# EAGLE schematic Haptic Sleeve Schematic (EAGLE 9.6.2)
DESIGNER: Grant Stankaitis
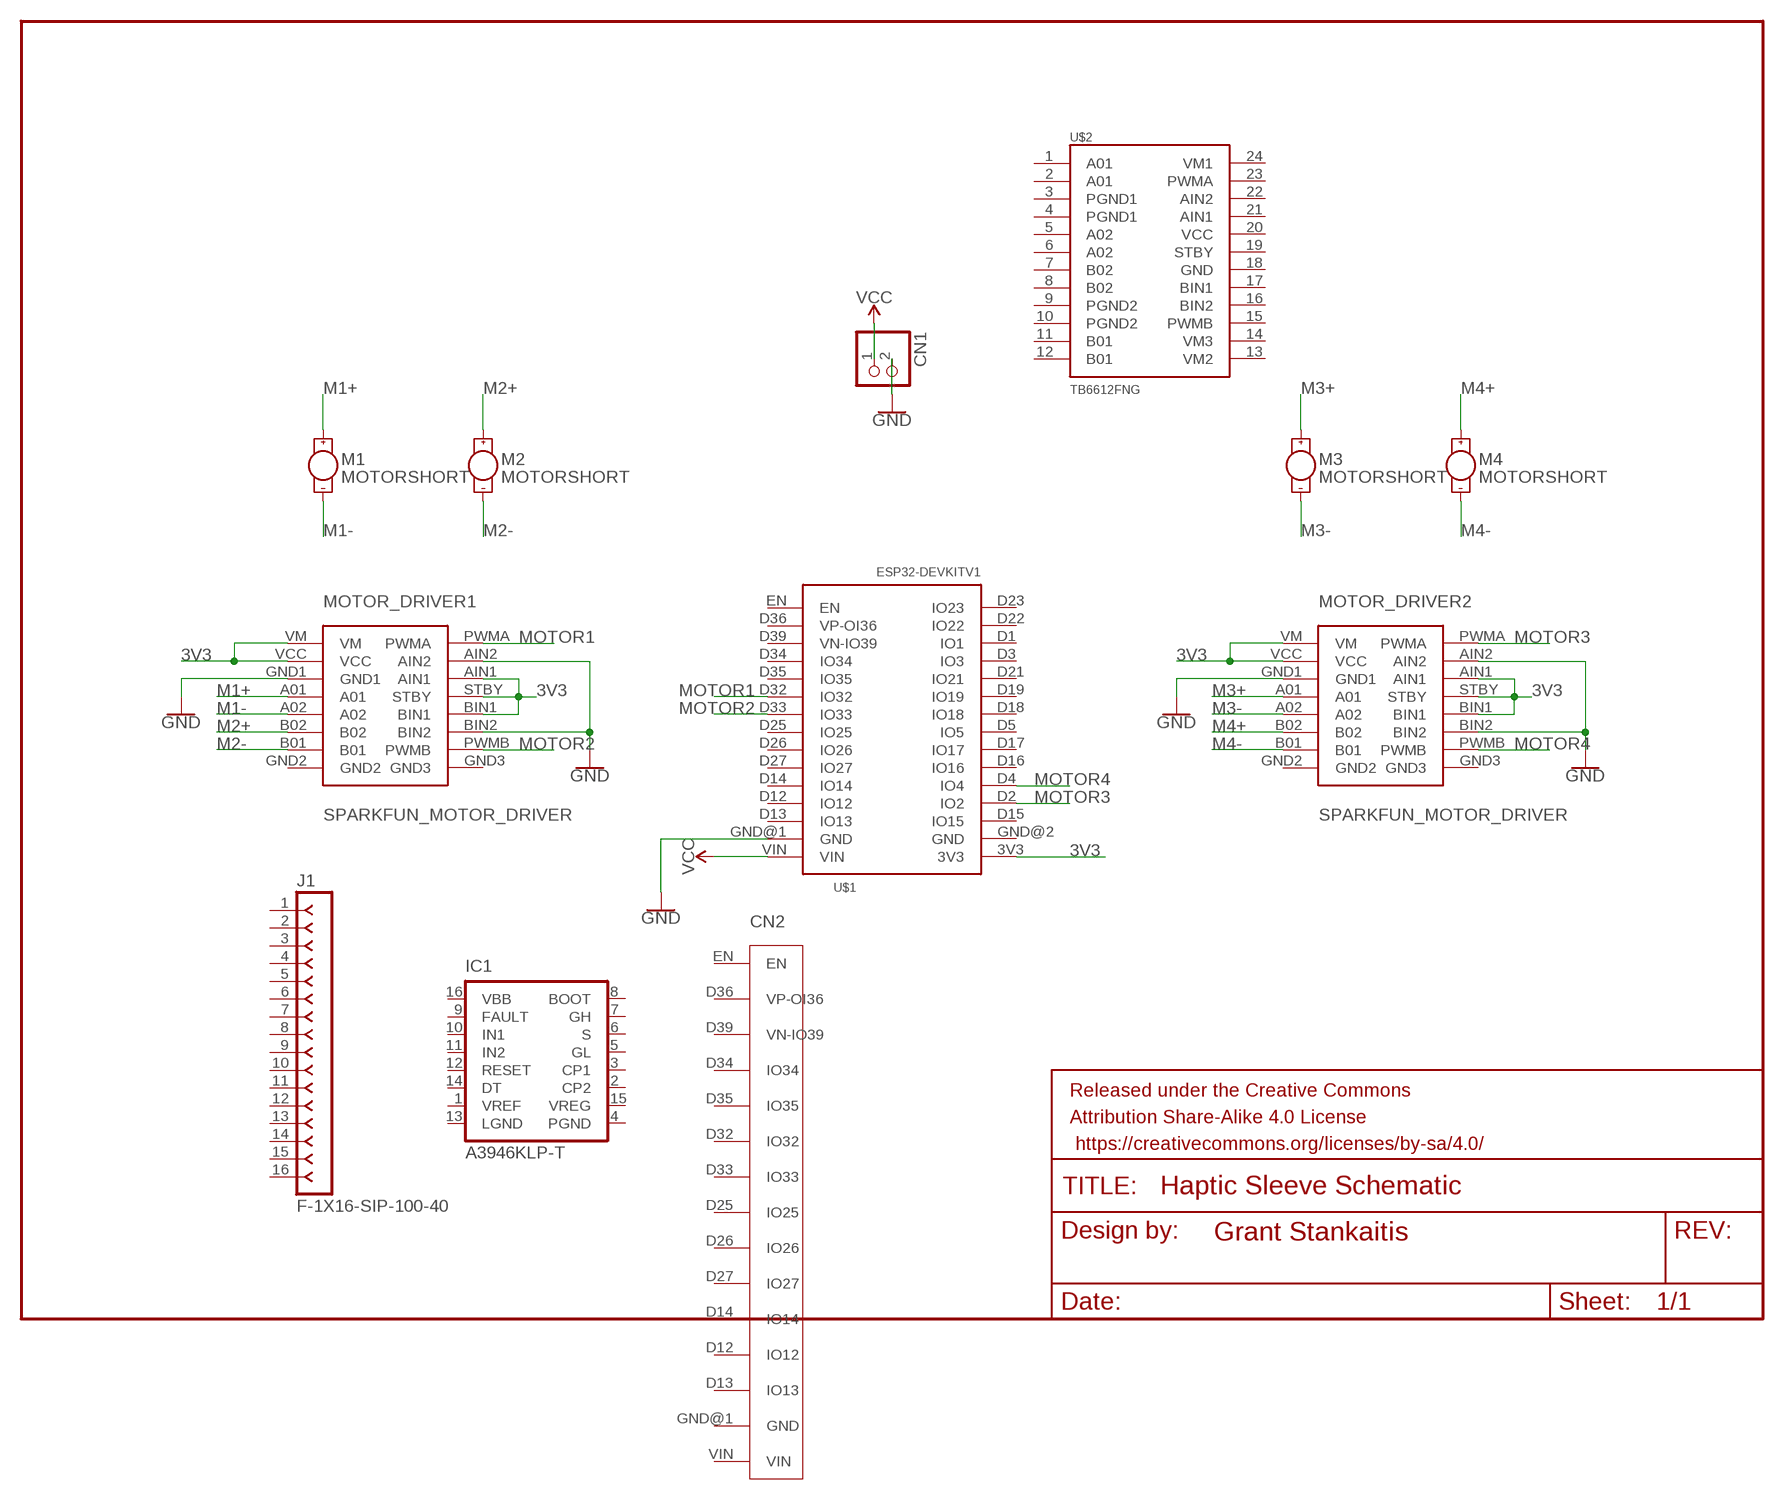
[diagram p0: schematic, sheet 1]

## Parts
CN1  JST_2PIN-THM-RA  [JST-PH-2-THM-RA]
CN2  CONNECTOR1  [1X16CONNECTORPACKAGE]
FRAME1  FRAME-LETTERNO_PACKAGE  [DUMMY]
IC1  A3946KLP-T  [TSSOP16E]
J1  F-1X16-SIP-100-40  [SIP-100-16-40]
M1  MOTORSHORT  [VIBE-MOTOR-10MM-SMD]
M2  MOTORSHORT  [VIBE-MOTOR-10MM-SMD]
M3  MOTORSHORT  [VIBE-MOTOR-10MM-SMD]
M4  MOTORSHORT  [VIBE-MOTOR-10MM-SMD]
MOTOR_DRIVER1  SPARKFUN_MOTOR_DRIVER  [SPARKFUN_MOTOR_DRIVER]
MOTOR_DRIVER2  SPARKFUN_MOTOR_DRIVER  [SPARKFUN_MOTOR_DRIVER]
U$1  ESP32DEVKITV1  [ESP32-DEVKITV1]
U$2  TB6612FNG  [SSOP24]

## Nets
3V3: MOTOR_DRIVER1.AIN1 MOTOR_DRIVER1.BIN1 MOTOR_DRIVER1.STBY MOTOR_DRIVER1.VCC MOTOR_DRIVER1.VM MOTOR_DRIVER2.AIN1 MOTOR_DRIVER2.BIN1 MOTOR_DRIVER2.STBY MOTOR_DRIVER2.VCC MOTOR_DRIVER2.VM U$1.3V3
GND: CN1.2 MOTOR_DRIVER1.AIN2 MOTOR_DRIVER1.BIN2 MOTOR_DRIVER1.GND1 MOTOR_DRIVER2.AIN2 MOTOR_DRIVER2.BIN2 MOTOR_DRIVER2.GND1 U$1.GND@1(GND)
M1+: M1.+ MOTOR_DRIVER1.A01
M1-: M1.- MOTOR_DRIVER1.A02
M2+: M2.+ MOTOR_DRIVER1.B02
M2-: M2.- MOTOR_DRIVER1.B01
M3+: M3.+ MOTOR_DRIVER2.A01
M3-: M3.- MOTOR_DRIVER2.A02
M4+: M4.+ MOTOR_DRIVER2.B02
M4-: M4.- MOTOR_DRIVER2.B01
MOTOR1: MOTOR_DRIVER1.PWMA U$1.D32(IO32)
MOTOR2: MOTOR_DRIVER1.PWMB U$1.D33(IO33)
MOTOR3: MOTOR_DRIVER2.PWMA U$1.D2(IO2)
MOTOR4: MOTOR_DRIVER2.PWMB U$1.D4(IO4)
VCC: CN1.1 U$1.VIN
Unconnected: CN2.D12(IO12) CN2.D13(IO13) CN2.D14(IO14) CN2.D25(IO25) CN2.D26(IO26) CN2.D27(IO27) CN2.D32(IO32) CN2.D33(IO33) CN2.D34(IO34) CN2.D35(IO35) CN2.D36(VP-OI36) CN2.D39(VN-IO39) CN2.EN CN2.GND@1(GND) CN2.VIN IC1.1(VREF) IC1.2(CP2) IC1.3(CP1) IC1.5(GL) IC1.6(S) IC1.7(GH) IC1.8(BOOT) IC1.9(FAULT) IC1.10(IN1) IC1.11(IN2) IC1.12(RESET) IC1.14(DT) IC1.15(VREG) IC1.16(VBB) J1.1 J1.2 J1.3 J1.4 J1.5 J1.6 J1.7 J1.8 J1.9 J1.10 J1.11 J1.12 J1.13 J1.14 J1.15 J1.16 MOTOR_DRIVER1.GND2 MOTOR_DRIVER1.GND3 MOTOR_DRIVER2.GND2 MOTOR_DRIVER2.GND3 U$1.D1(IO1) U$1.D3(IO3) U$1.D5(IO5) U$1.D12(IO12) U$1.D13(IO13) U$1.D14(IO14) U$1.D15(IO15) U$1.D16(IO16) U$1.D17(IO17) U$1.D18(IO18) U$1.D19(IO19) U$1.D21(IO21) U$1.D22(IO22) U$1.D23(IO23) U$1.D25(IO25) U$1.D26(IO26) U$1.D27(IO27) U$1.D34(IO34) U$1.D35(IO35) U$1.D36(VP-OI36) U$1.D39(VN-IO39) U$1.EN U$1.GND@2(GND) U$2.1(A01) U$2.2(A01) U$2.3(PGND1) U$2.4(PGND1) U$2.5(A02) U$2.6(A02) U$2.7(B02) U$2.8(B02) U$2.9(PGND2) U$2.10(PGND2) U$2.11(B01) U$2.12(B01) U$2.13(VM2) U$2.14(VM3) U$2.15(PWMB) U$2.16(BIN2) U$2.17(BIN1) U$2.18(GND) U$2.19(STBY) U$2.20(VCC) U$2.21(AIN1) U$2.22(AIN2) U$2.23(PWMA) U$2.24(VM1)

## Power pins joined to a net without a drawn wire
LGND: IC1.13(LGND)
PGND: IC1.4(PGND)

## Library data of the parts
CN1 = adafruit:JST_2PIN: JST 2-Pin Connectors of various flavors SMT-RA (S2B-PH-SM4) 4UConnector #17311 SMT (B2B-PH-SM4) THM-RA (S2B-PH) THM (B2B-PH)
CN2 = 1x16connector:CONNECTOR1
FRAME1 = SparkFun-Aesthetics:FRAME-LETTER: Schematic Frame - Letter Standard 8.5x11 US Letter frame; DESIGNER: Grant Stankaitis; VERSION: v01
IC1 = allegro:A3946: Half-Bridge Power MOSFET Controller Source: Data sheet <http://www.allegromicro.com/Products/Motor-Driver-And-Interface-ICs/Brushless-DC-Motor-Drivers/A3946.aspx>
J1 = con-headers-jp-1:F-1X16-: FEMALE HEADER
M1-M4 = SparkFun-MotorDriver:MOTOR: Motor (Single-Phase) Two-terminal, single-phase motors. SparkFun Products Vibration Motor <https://www.sparkfun.com/products/8449> (ROB-08449) Physical dimension and wire connections for this powerful vibration motor. Motor has a self adhesive backing.; PROD_ID: COMP-13709
MOTOR_DRIVER1 MOTOR_DRIVER2 = SparkFun-MotorDriver:SPARKFUN_MOTOR_DRIVER
U$1 = ESP32-DEVKITV1:ESP32DEVKITV1
U$2 = SparkFun-IC-Special-Function:TB6612FNG: Toshiba 1A dual motor driver IC-09363; PROD_ID: IC-09363